# Altium schematic sheet 总电路图.SchDoc
size A2; Organization: Altium Limited; Address1: L3, 12a Rodborough Rd; Address2: Frenchs Forest; Address3: NSW; Address4: Australia 2086
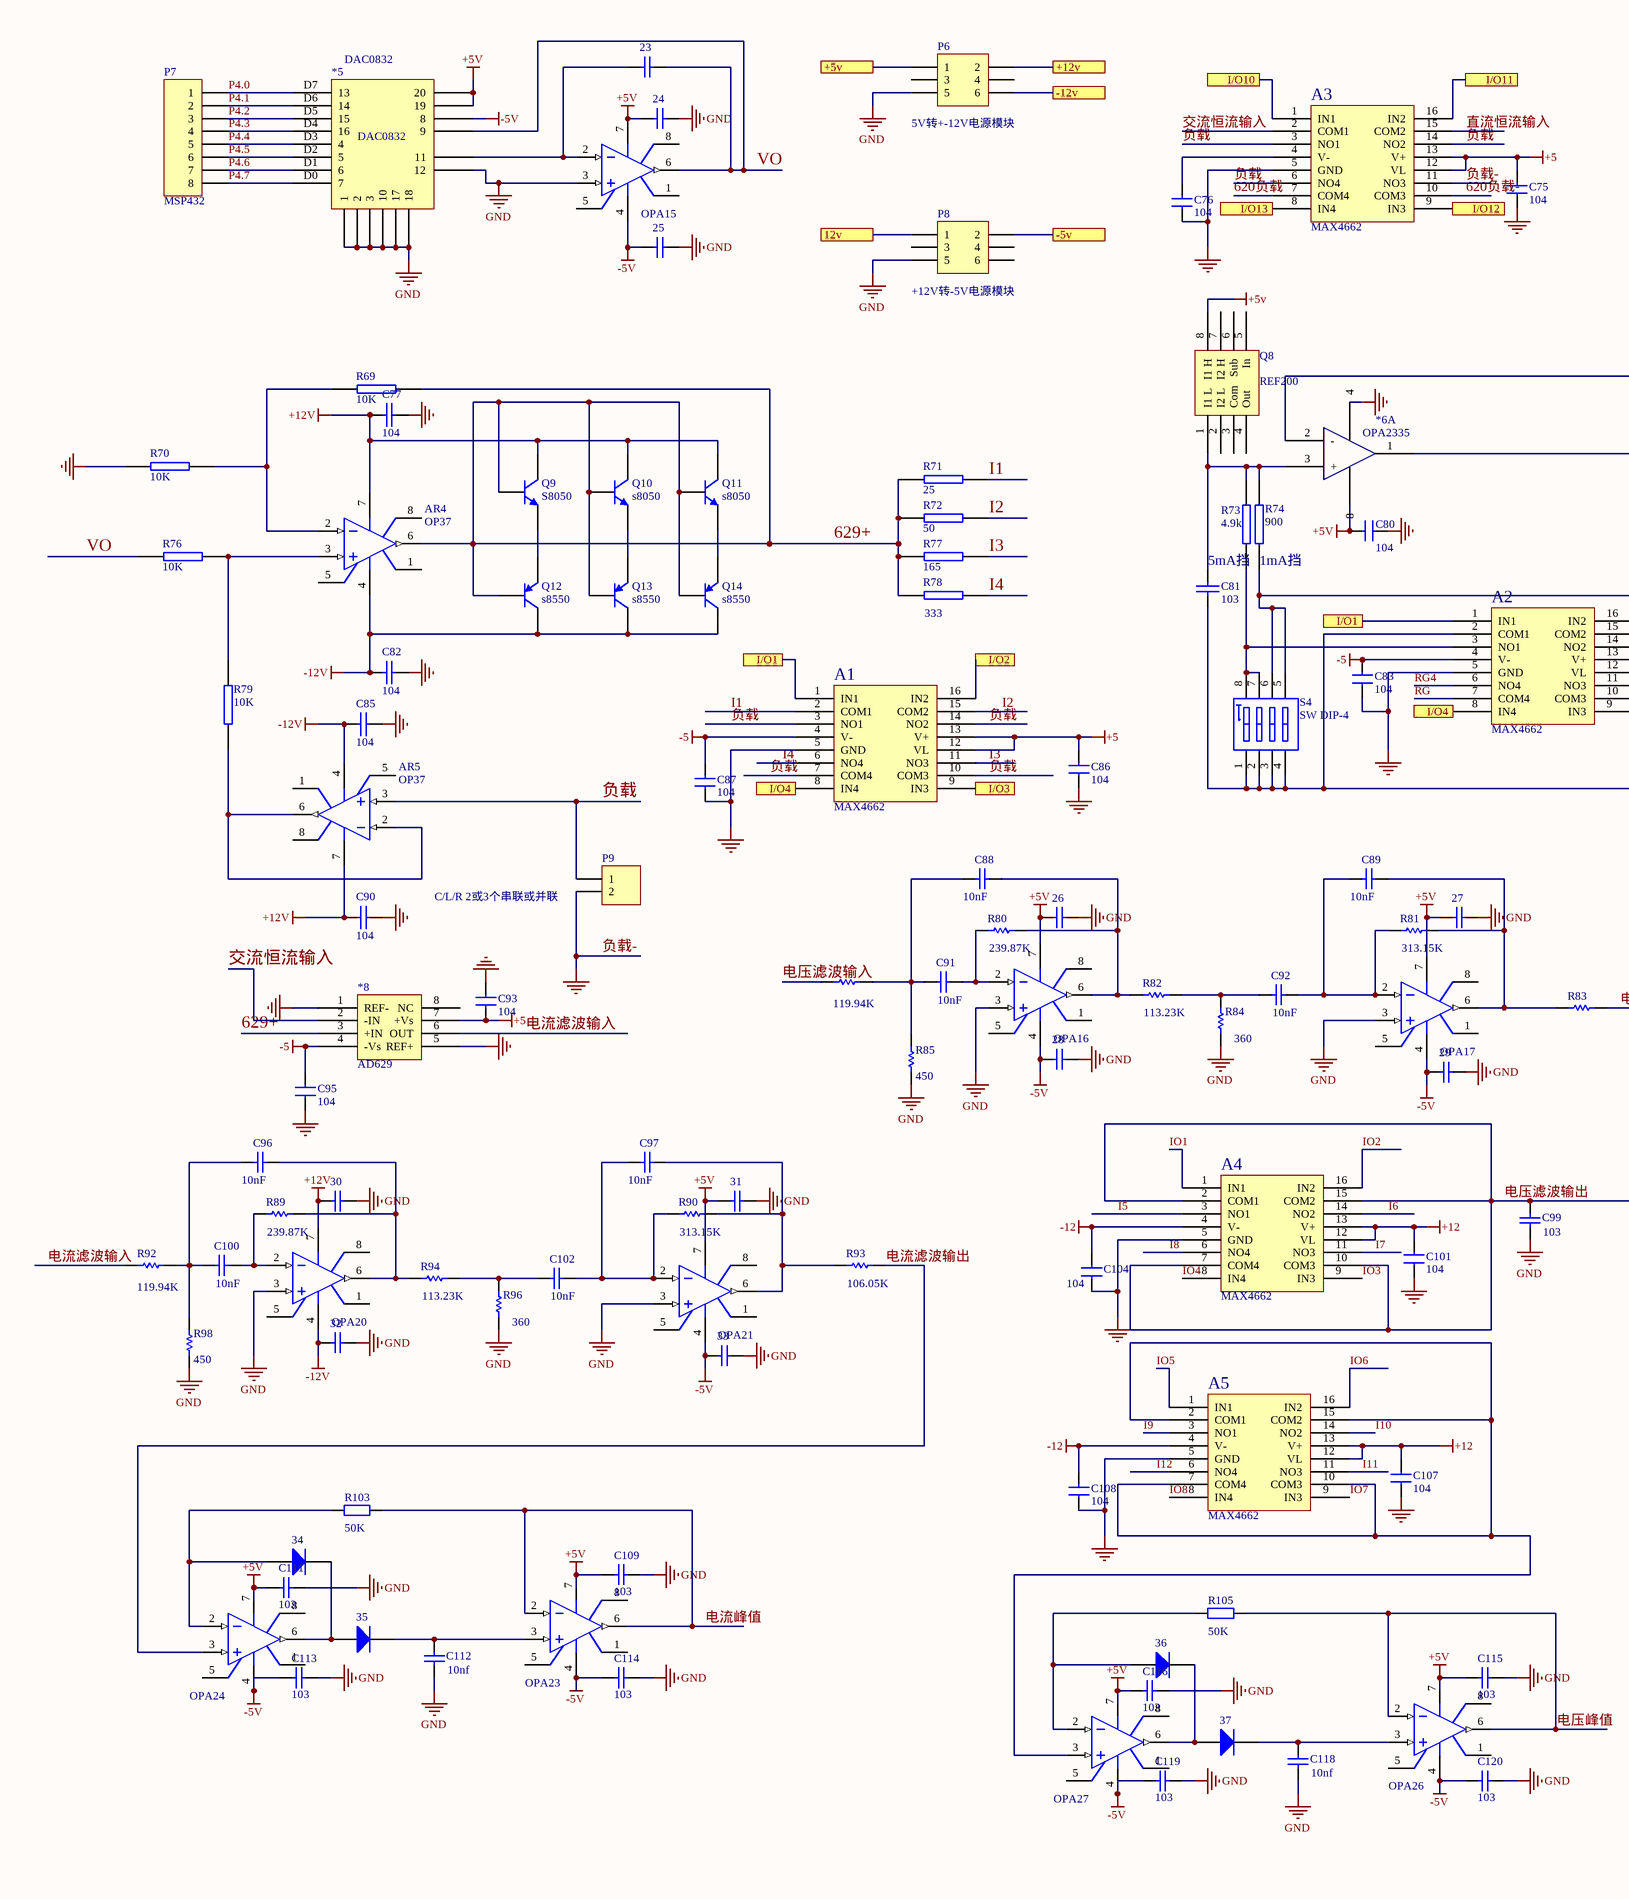
[diagram p0: 总电路图.SchDoc, left]
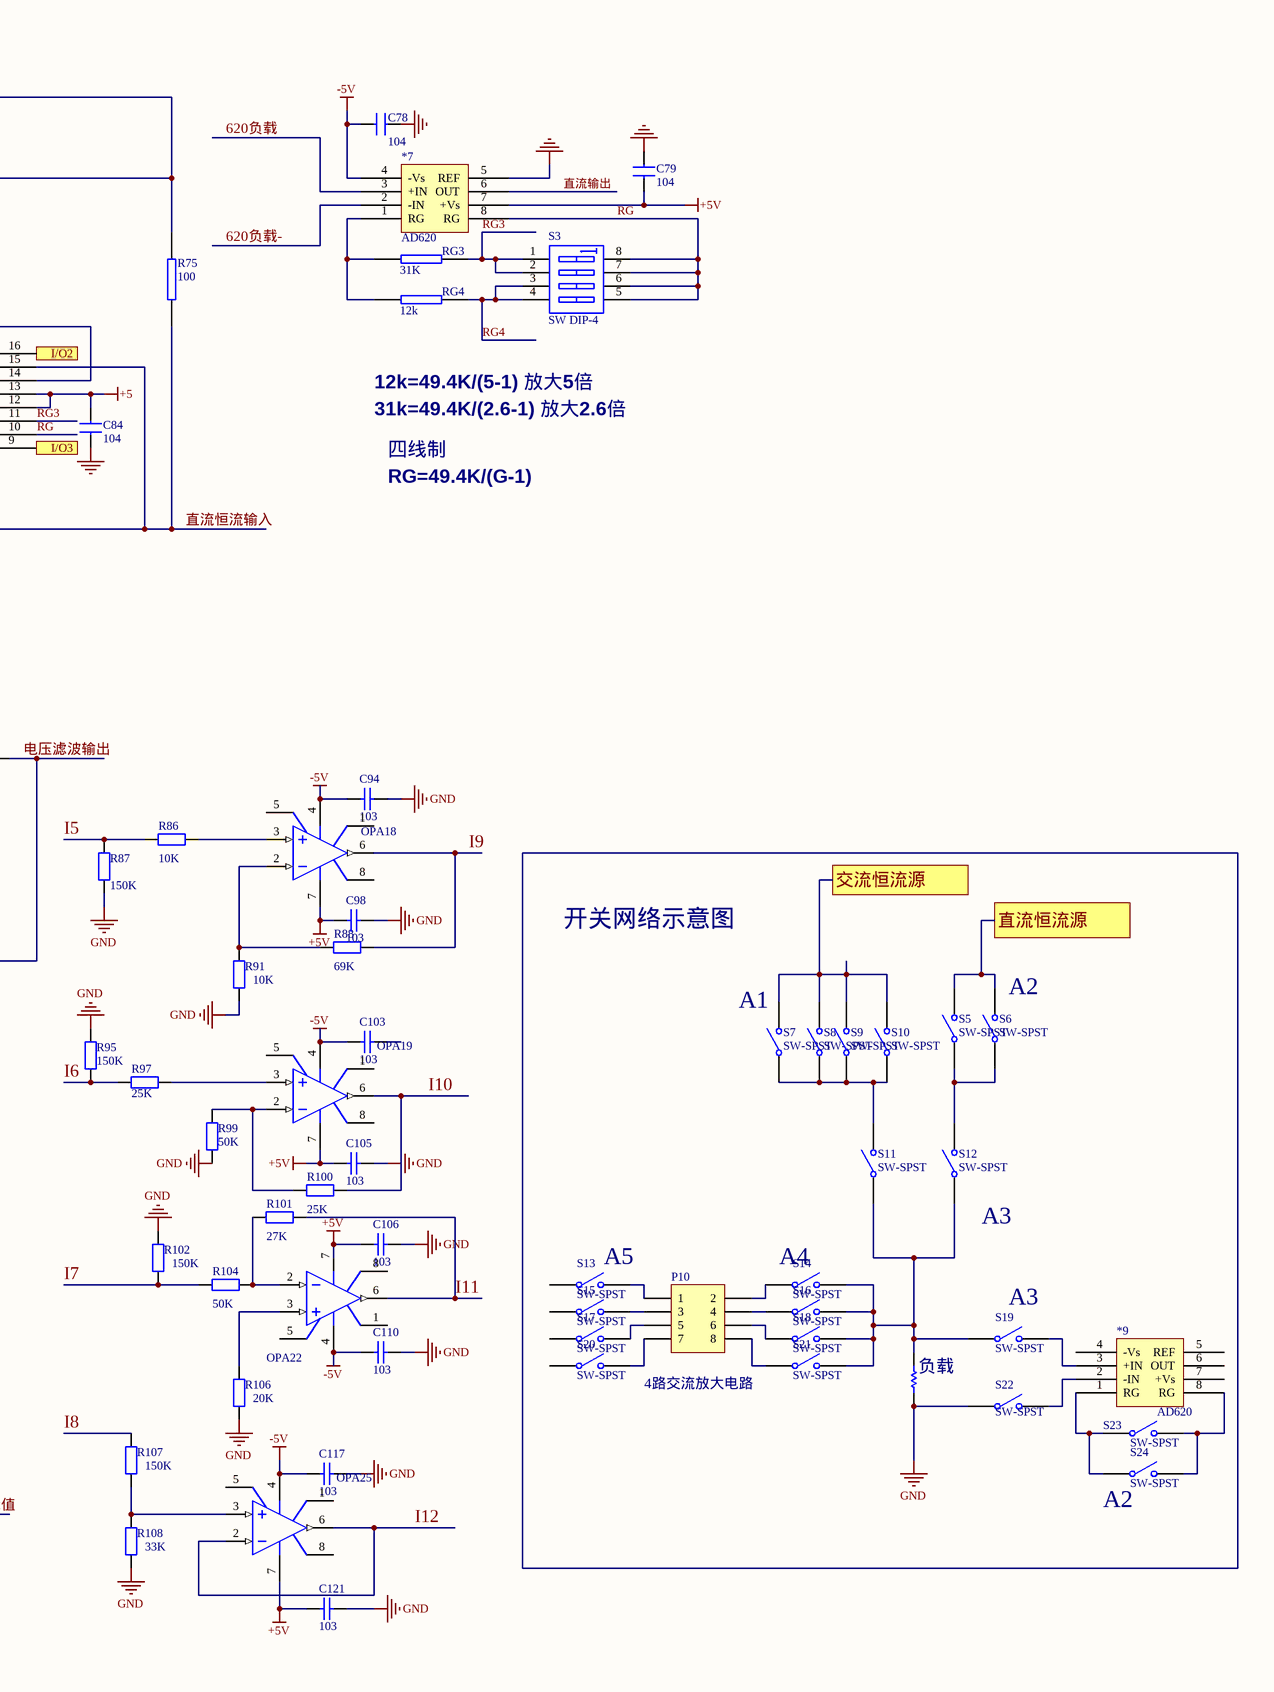
[diagram p1: 总电路图.SchDoc, right]

## Parts
23  Cap  [RAD-0.3]  (value not drawn)
24  Cap  [RAD-0.3]  (value not drawn)
25  Cap  [RAD-0.3]  (value not drawn)
26  Cap  [RAD-0.3]  (value not drawn)
27  Cap  [RAD-0.3]  (value not drawn)
28  Cap  [RAD-0.3]  (value not drawn)
29  Cap  [RAD-0.3]  (value not drawn)
30  Cap  [RAD-0.3]  (value not drawn)
31  Cap  [RAD-0.3]  (value not drawn)
32  Cap  [RAD-0.3]  (value not drawn)
33  Cap  [RAD-0.3]  (value not drawn)
34  Diode 1N4001  [DO-41]  (value not drawn)
35  Diode 1N4001  [DO-41]  (value not drawn)
36  Diode 1N4001  [DO-41]  (value not drawn)
37  Diode 1N4001  [DO-41]  (value not drawn)
*5  DAC0832
*6  OPA2335  (part A of 2)
*7  AD620
*8  AD629
*9  AD620
?  value 119.94K  [AXIAL-0.3]  (hidden comment: Res1)
A1  MAX4662
A2  MAX4662
A3  MAX4662
A4  MAX4662
A5  MAX4662
AR4  OP37  [H-08A]
AR5  OP37  [H-08A]
C75  104  [RAD0.1]
C76  104  [RAD0.1]
C77  104
C78  104  [RAD0.1]
C79  104  [RAD0.1]
C80  104  [RAD0.1]
C81  103
C82  104
C83  104  [RAD0.1]
C84  104  [RAD0.1]
C85  104
C86  104  [RAD0.1]
C87  104  [RAD0.1]
C88  value 10nF  [RAD-0.3]  (hidden comment: Cap)
C89  value 10nF  [RAD-0.3]  (hidden comment: Cap)
C90  104
C91  value 10nF  [RAD-0.3]  (hidden comment: Cap)
C92  value 10nF  [RAD-0.3]  (hidden comment: Cap)
C93  104  [RAD0.1]
C94  value 103  [RAD-0.3]  (hidden comment: Cap)
C95  104  [RAD0.1]
C96  value 10nF  [RAD-0.3]  (hidden comment: Cap)
C97  value 10nF  [RAD-0.3]  (hidden comment: Cap)
C98  value 103  [RAD-0.3]  (hidden comment: Cap)
C99  value 103  [RAD-0.3]  (hidden comment: Cap)
C100  value 10nF  [RAD-0.3]  (hidden comment: Cap)
C101  104  [RAD0.1]
C102  value 10nF  [RAD-0.3]  (hidden comment: Cap)
C103  value 103  [RAD-0.3]  (hidden comment: Cap)
C104  104  [RAD0.1]
C105  value 103  [RAD-0.3]  (hidden comment: Cap)
C106  value 103  [RAD-0.3]  (hidden comment: Cap)
C107  104  [RAD0.1]
C108  104  [RAD0.1]
C109  value 103  [RAD-0.3]  (hidden comment: Cap)
C110  value 103  [RAD-0.3]  (hidden comment: Cap)
C111  value 103  [RAD-0.3]  (hidden comment: Cap)
C112  value 10nf  [RAD-0.3]  (hidden comment: Cap)
C113  value 103  [RAD-0.3]  (hidden comment: Cap)
C114  value 103  [RAD-0.3]  (hidden comment: Cap)
C115  value 103  [RAD-0.3]  (hidden comment: Cap)
C116  value 103  [RAD-0.3]  (hidden comment: Cap)
C117  value 103  [RAD-0.3]  (hidden comment: Cap)
C118  value 10nf  [RAD-0.3]  (hidden comment: Cap)
C119  value 103  [RAD-0.3]  (hidden comment: Cap)
C120  value 103  [RAD-0.3]  (hidden comment: Cap)
C121  value 103  [RAD-0.3]  (hidden comment: Cap)
OPA15  Op Amp  [H-08A]  (value not drawn)
OPA16  Op Amp  [H-08A]  (value not drawn)
OPA17  Op Amp  [H-08A]  (value not drawn)
OPA18  Op Amp  [H-08A]  (value not drawn)
OPA19  Op Amp  [H-08A]  (value not drawn)
OPA20  Op Amp  [H-08A]  (value not drawn)
OPA21  Op Amp  [H-08A]  (value not drawn)
OPA22  Op Amp  [H-08A]  (value not drawn)
OPA23  Op Amp  [H-08A]  (value not drawn)
OPA24  Op Amp  [H-08A]  (value not drawn)
OPA25  Op Amp  [H-08A]  (value not drawn)
OPA26  Op Amp  [H-08A]  (value not drawn)
OPA27  Op Amp  [H-08A]  (value not drawn)
P6  5V转+-12V电源模块  [HDR2X3]
P7  MSP432  [HDR1X8]
P8  +12V转-5V电源模块  [HDR2X3]
P9  C/L/R 2或3个串联或并联  [HDR1X2H]
P10  4路交流放大电路  [HDR2X4]
Q8  REF200
Q9  S8050  [TO-92A]
Q10  s8050  [TO-92A]
Q11  s8050  [TO-92A]
Q12  s8550  [TO-92A]
Q13  s8550  [TO-92A]
Q14  s8550  [TO-92A]
R69  10K
R70  10K
R71  25
R72  50
R73  4.9k
R74  900
R75  100
R76  10K
R77  165
R78  333  [AXIAL0.3]
R79  10K
R80  value 239.87K  [AXIAL-0.3]  (hidden comment: Res1)
R81  value 313.15K  [AXIAL-0.3]  (hidden comment: Res1)
R82  value 113.23K  [AXIAL-0.3]  (hidden comment: Res1)
R83  Res1  [AXIAL-0.3]  (value not drawn)
R84  value 360  [AXIAL-0.3]  (hidden comment: Res1)
R85  value 450  [AXIAL-0.3]  (hidden comment: Res1)
R86  value 10K  [AXIAL-0.4]  (hidden comment: Res2)
R87  value 150K  [AXIAL-0.4]  (hidden comment: Res2)
R88  value 69K  [AXIAL-0.4]  (hidden comment: Res2)
R89  value 239.87K  [AXIAL-0.3]  (hidden comment: Res1)
R90  value 313.15K  [AXIAL-0.3]  (hidden comment: Res1)
R91  value 10K  [AXIAL-0.4]  (hidden comment: Res2)
R92  value 119.94K  [AXIAL-0.3]  (hidden comment: Res1)
R93  value 106.05K  [AXIAL-0.3]  (hidden comment: Res1)
R94  value 113.23K  [AXIAL-0.3]  (hidden comment: Res1)
R95  value 150K  [AXIAL-0.4]  (hidden comment: Res2)
R96  value 360  [AXIAL-0.3]  (hidden comment: Res1)
R97  value 25K  [AXIAL-0.4]  (hidden comment: Res2)
R98  value 450  [AXIAL-0.3]  (hidden comment: Res1)
R99  value 50K  [AXIAL-0.4]  (hidden comment: Res2)
R100  value 25K  [AXIAL-0.4]  (hidden comment: Res2)
R101  value 27K  [AXIAL-0.4]  (hidden comment: Res2)
R102  value 150K  [AXIAL-0.4]  (hidden comment: Res2)
R103  value 50K  [AXIAL-0.4]  (hidden comment: Res2)
R104  value 50K  [AXIAL-0.4]  (hidden comment: Res2)
R105  value 50K  [AXIAL-0.4]  (hidden comment: Res2)
R106  value 20K  [AXIAL-0.4]  (hidden comment: Res2)
R107  value 150K  [AXIAL-0.4]  (hidden comment: Res2)
R108  value 33K  [AXIAL-0.4]  (hidden comment: Res2)
RG3  31K  [AXIAL0.3]
RG4  12k  [AXIAL0.3]
S3  SW DIP-4  [SO8_N]
S4  SW DIP-4  [SO8_N]
S5  SW-SPST  [SPST-2]
S6  SW-SPST  [SPST-2]
S7  SW-SPST  [SPST-2]
S8  SW-SPST  [SPST-2]
S9  SW-SPST  [SPST-2]
S10  SW-SPST  [SPST-2]
S11  SW-SPST  [SPST-2]
S12  SW-SPST  [SPST-2]
S13  SW-SPST  [SPST-2]
S14  SW-SPST  [SPST-2]
S15  SW-SPST  [SPST-2]
S16  SW-SPST  [SPST-2]
S17  SW-SPST  [SPST-2]
S18  SW-SPST  [SPST-2]
S19  SW-SPST  [SPST-2]
S20  SW-SPST  [SPST-2]
S21  SW-SPST  [SPST-2]
S22  SW-SPST  [SPST-2]
S23  SW-SPST  [SPST-2]
S24  SW-SPST  [SPST-2]
负载  Res1  [AXIAL-0.3]  (value not drawn)

## Ports
12v, +5v, +12v, -5v, -12v, I/O1, I/O2, I/O3, I/O4, I/O10, I/O11, I/O12, I/O13, 交流恒流源, 直流恒流源

## Nets
+5: *8.7(+Vs) A1.12(VL) A1.13(V+) A2.12(VL) A2.13(V+) A3.12(VL) A3.13(V+) C75.1 C84.1 C86.1 C93.1
+5V: 24.1 26.1 27.1 31.1 *5.D14(20) *5.D15(19) *7.7(+Vs) C79.1 C80.1 C98.2 C105.2 C106.2 C109.2 C111.2 C115.2 C116.2 C121.2 OPA15.7(V+) OPA16.7(V+) OPA17.7(V+) OPA18.7(V+) OPA19.7(V+) OPA21.7(V+) OPA22.7(V+) OPA23.7(V+) OPA24.7(V+) OPA25.7(V+) OPA26.7(V+) OPA27.7(V+) Q8.8(I1_H)
+12: A4.12(VL) A4.13(V+) A5.12(VL) A5.13(V+) C101.1 C107.1
+12V: 30.1 AR4.7(V+) AR5.7(V+) C77.1 C90.1 OPA20.7(V+) Q9.3(C) Q10.3(C) Q11.3(C)
-5: *8.4(-Vs) A1.4(V-) A2.4(V-) C83.2 C87.2 C95.1
-5V: 25.1 28.1 29.1 33.1 *5.D16(8) *7.4(-Vs) C78.1 C94.2 C103.2 C110.2 C113.2 C114.2 C117.2 C119.2 C120.2 OPA15.4(V-) OPA16.4(V-) OPA17.4(V-) OPA18.4(V-) OPA19.4(V-) OPA21.4(V-) OPA22.4(V-) OPA23.4(V-) OPA24.4(V-) OPA25.4(V-) OPA26.4(V-) OPA27.4(V-)
-12: A4.4(V-) A5.4(V-) C104.2 C108.2
-12V: 32.1 AR4.4(V-) AR5.4(V-) C82.1 C85.1 OPA20.4(V-) Q12.3(C) Q13.3(C) Q14.3(C)
GND: 24.2 25.2 26.2 27.2 28.2 29.2 30.2 31.2 32.2 33.2 *5.D8(1) *5.D9(2) *5.D10(3) *5.D11(10) *5.D12(17) *5.D13(18) *5.D19(12) A1.5(GND) A2.5(GND) A3.5(GND) A4.5(GND) A5.5(GND) C75.2 C76.1 C77.2 C78.2 C79.2 C80.2 C82.2 C83.1 C84.2 C85.2 C86.2 C87.1 C90.2 C93.2 C94.1 C95.2 C98.1 C99.1 C101.2 C104.1 C105.1 C106.1 C107.2 C108.1 C109.1 C110.1 C111.1 C112.2 C113.1 C114.1 C115.1 C116.1 C117.1 C118.2 C119.1 C120.1 C121.1 OPA15.3(IN+) OPA16.3(IN+) OPA17.3(IN+) OPA20.3(IN+) OPA21.3(IN+) P6.5 P8.5 R70.2 R84.1 R85.1 R87.2 R91.1 R95.2 R96.1 R98.1 R99.1 R102.2 R106.2 R108.2 S22.1(COMMON) 负载.1
负载-: *7.5(REF) *8.1(REF-) *8.5(REF+) A3.11(NO3) P9.2
12v: P8.1 ; port 12v
620负载: *7.3(+IN) A3.7(COM4)
620负载-: *7.2(-IN) A3.10(COM3)
629+: *8.3(+IN) AR4.6(OUT) Q9.2(B) Q10.2(B) Q11.2(B) Q12.2(B) Q13.2(B) Q14.2(B) R69.2 R71.1 R72.1 R77.1 R78.2
+5v: P6.1 ; port +5v  [a separate net that carries the same name]
+12v: P6.2 ; port +12v  [a separate net that carries the same name]
-5v: P8.2 ; port -5v  [a separate net that carries the same name]
-12v: P6.6 ; port -12v  [a separate net that carries the same name]
I1: A1.2(COM1) R71.2
I2: A1.15(COM2) R72.2
I3: A1.11(NO3) R77.2
I4: A1.6(NO4) R78.1
I5: A4.3(NO1) R86.1 R87.1
I6: A4.14(NO2) R95.1 R97.1
I7: A4.11(NO3) R102.1 R104.2
I8: A4.6(NO4) R107.1
I9: A5.3(NO1) OPA18.6(OUT) R88.1
I10: A5.14(NO2) OPA19.6(OUT) R100.1
I11: A5.11(NO3) OPA22.6(OUT) R101.1
I12: A5.6(NO4) OPA25.2(IN-) OPA25.6(OUT)
I/O1: A1.1(IN1) A2.1(IN1) ; port I/O1
I/O2: A1.16(IN2) A2.16(IN2) ; port I/O2
I/O3: A1.9(IN3) A2.9(IN3) ; port I/O3
I/O4: A1.8(IN4) A2.8(IN4) ; port I/O4
I/O10: A3.1(IN1) ; port I/O10
I/O11: A3.16(IN2) ; port I/O11
I/O12: A3.9(IN3) ; port I/O12
I/O13: A3.8(IN4) ; port I/O13
IO1: A4.1(IN1)
IO2: A4.16(IN2)
IO3: A4.9(IN3)
IO4: A4.8(IN4)
IO5: A5.1(IN1)
IO6: A5.16(IN2)
IO7: A5.9(IN3)
IO8: A5.8(IN4)
P4.0: *5.D7(13) P7.1
P4.1: *5.D6(14) P7.2
P4.2: *5.D5(15) P7.3
P4.3: *5.D4(16) P7.4
P4.4: *5.D3(4) P7.5
P4.5: *5.D2(5) P7.6
P4.6: *5.D1(6) P7.7
P4.7: *5.D0(7) P7.8
RG: *7.8(RG) A2.7(COM4) A2.10(COM3) S3.5(B4) S3.6(B3) S3.7(B2) S3.8(B1)
RG3: A2.11(NO3) RG3.2 S3.1(A1) S3.2(A2)
RG4: A2.6(NO4) RG4.2 S3.3(A3) S3.4(A4)
VO: 23.2 *5.D17(9) OPA15.6(OUT) R76.1
交流恒流源: S7.2(NO) S8.2(NO) S9.2(NO) S10.2(NO) ; port 交流恒流源
交流恒流输入: *8.2(-IN) A3.2(COM1)
电压峰值: OPA26.2(IN-) OPA26.6(OUT) R105.2
电压滤波输入: ?.1
电压滤波输出: A4.2(COM1) A4.7(COM4) A4.10(COM3) A4.15(COM2) C99.2 R83.2
电流峰值: OPA23.2(IN-) OPA23.6(OUT) R103.2
电流滤波输入: *8.6(OUT) R92.1
电流滤波输出: OPA24.3(IN+) R93.2
直流恒流源: S5.2(NO) S6.2(NO) ; port 直流恒流源
直流恒流输入: A2.2(COM1) A2.15(COM2) A3.15(COM2) C81.1 R75.1 S4.1(A1) S4.2(A2) S4.3(A3) S4.4(A4)
直流输出: *7.6(OUT)
负载: A1.3(NO1) A1.7(COM4) A1.10(COM3) A1.14(NO2) A3.3(NO1) A3.6(NO4) A3.14(NO2) AR5.3(IN+) P9.1
Net23_1: 23.1 *5.D18(11) OPA15.2(IN-)
Net34_1: 34.1(A) OPA24.2(IN-) R103.1
Net34_2: 34.2(K) 35.1(A) OPA24.6(OUT)
Net35_2: 35.2(K) C112.1 OPA23.3(IN+)
Net36_1: 36.1(A) OPA27.2(IN-) R105.1
Net36_2: 36.2(K) 37.1(A) OPA27.6(OUT)
Net37_2: 37.2(K) C118.1 OPA26.3(IN+)
Net*6_1: *6.1 *6.2(-) R75.2
Net*6_3: *6.3(+) C81.2 Q8.1(I1_L) R73.2 R74.2
Net*7_1: *7.1(RG) RG3.1 RG4.1
Net*9_1: *9.1(RG) S23.1(COMMON) S24.1(COMMON)
Net*9_2: *9.2(-IN) S22.2(NO)
Net*9_3: *9.3(+IN) S19.2(NO)
Net*9_8: *9.8(RG) S23.2(NO) S24.2(NO)
Net?_2: ?.2 C88.1 C91.1 R85.2
NetA2_3: A2.3(NO1) R73.1 S4.7(B2) S4.8(B1)
NetA2_14: A2.14(NO2) R74.1 S4.5(B4) S4.6(B3)
NetA3_4: A3.4(V-) C76.2
NetA5_2: A5.2(COM1) A5.7(COM4) A5.10(COM3) A5.15(COM2) OPA27.3(IN+)
NetAR4_2: AR4.2(IN-) R69.1 R70.1
NetAR4_3: AR4.3(IN+) R76.2 R79.1
NetAR5_2: AR5.2(IN-) AR5.6(OUT) R79.2
NetC88_2: C88.2 OPA16.6(OUT) R80.2 R82.1
NetC89_1: C89.1 C92.2 OPA17.2(IN-) R81.1
NetC89_2: C89.2 OPA17.6(OUT) R81.2 R83.1
NetC91_2: C91.2 OPA16.2(IN-) R80.1
NetC92_1: C92.1 R82.2 R84.2
NetC96_1: C96.1 C100.1 R92.2 R98.2
NetC96_2: C96.2 OPA20.6(OUT) R89.2 R94.1
NetC97_1: C97.1 C102.2 OPA21.2(IN-) R90.1
NetC97_2: C97.2 OPA21.6(OUT) R90.2 R93.1
NetC100_2: C100.2 OPA20.2(IN-) R89.1
NetC102_1: C102.1 R94.2 R96.2
NetOPA18_2: OPA18.2(IN-) R88.2 R91.2
NetOPA18_3: OPA18.3(IN+) R86.2
NetOPA19_2: OPA19.2(IN-) R99.2 R100.2
NetOPA19_3: OPA19.3(IN+) R97.2
NetOPA22_2: OPA22.2(IN-) R101.2 R104.1
NetOPA22_3: OPA22.3(IN+) R106.1
NetOPA25_3: OPA25.3(IN+) R107.2 R108.1
NetP10_1: P10.1 S13.2(NO)
NetP10_2: P10.2 S14.1(COMMON)
NetP10_3: P10.3 S15.2(NO)
NetP10_4: P10.4 S16.1(COMMON)
NetP10_5: P10.5 S17.2(NO)
NetP10_6: P10.6 S18.1(COMMON)
NetP10_7: P10.7 S20.2(NO)
NetP10_8: P10.8 S21.1(COMMON)
NetQ9_1: Q9.1(E) Q12.1(E)
NetQ10_1: Q10.1(E) Q13.1(E)
NetQ11_1: Q11.1(E) Q14.1(E)
NetS5_1: S5.1(COMMON) S6.1(COMMON) S12.2(NO)
NetS7_1: S7.1(COMMON) S8.1(COMMON) S9.1(COMMON) S10.1(COMMON) S11.2(NO)
NetS11_1: S11.1(COMMON) S12.1(COMMON) S14.2(NO) S16.2(NO) S18.2(NO) S19.1(COMMON) S21.2(NO) 负载.2

Not connected (* = marked no-connect by the designer): *6 ?1(4) ?2(8); *8 8(NC); *9 4(-Vs) 5(REF) 6(OUT) 7(+Vs); AR4 1(OS_NUL) 5(OS_NUL) 8(TAB); AR5 1(OS_NUL) 5(OS_NUL) 8(TAB); C103 1; OPA15 1(OS_NUL) 5(OS_NUL) 8(TAB); OPA16 1(OS_NUL) 5(OS_NUL) 8(TAB); OPA17 1(OS_NUL) 5(OS_NUL) 8(TAB); OPA18 1(OS_NUL) 5(OS_NUL) 8(TAB); OPA19 1(OS_NUL) 5(OS_NUL) 8(TAB); OPA20 1(OS_NUL) 5(OS_NUL) 8(TAB); OPA21 1(OS_NUL) 5(OS_NUL) 8(TAB); OPA22 1(OS_NUL) 5(OS_NUL) 8(TAB); OPA23 1(OS_NUL) 5(OS_NUL) 8(TAB); OPA24 1(OS_NUL) 5(OS_NUL) 8(TAB); OPA25 1(OS_NUL) 5(OS_NUL) 8(TAB); OPA26 1(OS_NUL) 5(OS_NUL) 8(TAB); OPA27 1(OS_NUL) 5(OS_NUL) 8(TAB); P6 3 4; P8 3 4 6; Q8 2(I2_L) 3(Com) 4(Out) 5(In) 6(Sub) 7(I2_H); S13 1(COMMON); S15 1(COMMON); S17 1(COMMON); S20 1(COMMON)

## Notes on the sheet
- 5mA挡
- 1mA挡
- 12k=49.4K/(5-1) 放大5倍
- 31k=49.4K/(2.6-1) 放大2.6倍
- 四线制
- RG=49.4K/(G-1)
- 开关网络示意图
- (near S7) A1
- (near S6) A2
- (near S13) A5
- (near S14) A4
- (near S12) A3
- (near S19) A3
- (near S24) A2
- Title
- Size:
- Date:
- File:
- Number:
- Time:
- Revision:
- Sheet
- of

## Library data of the parts
23-33 = Cap: Capacitor; Value: 100pF; Published: 8-Jun-2000; LatestRevisionDate: 17-Jul-2002; LatestRevisionNote: Re-released for DXP Platform.; PackageReference: RAD-0.3; Publisher: Altium Limited; PackageDescription: Radial Cap, Thru-Hole; 2 Leads; 0.3 in Pin Spacing
34-37 = Diode 1N4001: 1 Amp General Purpose Rectifier; Published: 8-Jun-2000; LatestRevisionDate: 17-Jul-2002; LatestRevisionNote: Re-released for DXP Platform.; DatasheetVersion: 1998; PackageVersion: Aug-1999; PackageReference: DO-41; Publisher: Altium Limited; PackageDescription: Diode, Axial; Body 5.2 x 2.7 mm (LxDia. max), Lead Dia. 0.86 mm (max); Code_JEDEC: DO-204-AL; ComponentLink1Description: Manufacturer Link; ComponentLink1URL: http://www.fairchildsemi.com/; ComponentLink2Description: Datasheet; ComponentLink2URL: http://www.fairchildsemi.com/ds/1N%2F1N4001.pdf
*5 Q8 = Component_1
? R80-R85 R89 R90 R92-R94 R96 R98 负载 = Res1: Resistor; Published: 8-Jun-2000; LatestRevisionDate: 17-Jul-2002; LatestRevisionNote: Re-released for DXP Platform.; PackageReference: AXIAL-0.3; Publisher: Altium Limited; PackageDescription: Axial Device, Thru-Hole; 2 Leads; 0.3 in Pin Spacing
A1-A5 = MAX2662
AR4 AR5 OPA15-OPA27 = Op Amp: FET Operational Amplifier; Published: 8-Jun-2000; LatestRevisionDate: 17-Jul-2002; LatestRevisionNote: Re-released for DXP Platform.; DatasheetVersion: REV. B; PackageVersion: 1990; PackageReference: H-08A; Publisher: Altium Limited; PackageDescription: Can; 8 Leads; Pin Circle Dia. 5.08 mm; Lead Dia. 0.53 mm (max); ComponentLink1Description: Manufacturer Link; ComponentLink1URL: http://www.analog.com/
C75-C87 C90 C93 C95 C101 C104 C107 C108 = CAP: Capacitor
  C75 C76 C78-C80 C83 C84 C86 C87 C93 C95 C101 C104 C107 C108: Value: 104
C88 C89 C91 C92 C94 C96-C100 C102 C103 C105 C106 C109-C121 = Cap: Capacitor; Published: 8-Jun-2000; LatestRevisionDate: 17-Jul-2002; LatestRevisionNote: Re-released for DXP Platform.; PackageReference: RAD-0.3; Publisher: Altium Limited; PackageDescription: Radial Cap, Thru-Hole; 2 Leads; 0.3 in Pin Spacing
P6 P8 = Header 3X2: Header, 3-Pin, Dual row; LatestRevisionDate: 17-Jul-2002; LatestRevisionNote: Re-released for DXP Platform.; Publisher: Altium Limited
P7 = Header 8: Header, 8-Pin; LatestRevisionDate: 17-Jul-2002; LatestRevisionNote: Re-released for DXP Platform.; Publisher: Altium Limited
P9 = Header 2H: Header, 2-Pin, Right Angle; LatestRevisionDate: 17-Jul-2002; LatestRevisionNote: Re-released for DXP Platform.; Publisher: Altium Limited
P10 = Header 4X2: Header, 4-Pin, Dual row; LatestRevisionDate: 17-Jul-2002; LatestRevisionNote: Re-released for DXP Platform.; Publisher: Altium Limited
Q9-Q11 = 2N3904: NPN General Purpose Amplifier; Published: 8-Jun-2000; LatestRevisionDate: 15-Jan-2003; LatestRevisionNote: PCB Footprint 'BCY-W3/D4.7' replaced; DatasheetVersion: 1997; PackageVersion: Sep-1998; PackageReference: TO-92A; Publisher: Altium Limited; PackageDescription: TO, Flat Index; 3 In-Line, Axial Leads; Body Dia. 4.5mm; Leads 0.51 x 0.48 mm (max); ComponentLink1Description: Manufacturer Link; ComponentLink1URL: http://www.fairchildsemi.com/; ComponentLink2Description: Datasheet; ComponentLink2URL: http://www.fairchildsemi.com/ds/2N%2F2N3904.pdf
Q12-Q14 = 2N3906: PNP General Purpose Amplifier; Published: 8-Jun-2000; LatestRevisionDate: 15-Jan-2003; LatestRevisionNote: PCB Footprint 'BCY-W3/D4.7' replaced; DatasheetVersion: 1997; PackageVersion: Sep-1998; PackageReference: TO-92A; Publisher: Altium Limited; PackageDescription: TO, Flat Index; 3 In-Line, Axial Leads; Body Dia. 4.5mm; Leads 0.51 x 0.48 mm (max); ComponentLink1Description: Manufacturer Link; ComponentLink1URL: http://www.fairchildsemi.com/; ComponentLink2Description: Datasheet; ComponentLink2URL: http://www.fairchildsemi.com/ds/2N%2F2N3906.pdf
R69-R79 RG3 RG4 = RES2
R86-R88 R91 R95 R97 R99-R108 = Res2: Resistor; Published: 8-Jun-2000; LatestRevisionDate: 17-Jul-2002; LatestRevisionNote: Re-released for DXP Platform.; PackageReference: AXIAL-0.4; Publisher: Altium Limited; PackageDescription: Axial Device, Thru-Hole; 2 Leads; 0.4 in Pin Spacing
S3 S4 = SW DIP-4: DIP Switch, 4 Position, SPST; Published: 24-Mar-1999; LatestRevisionDate: 29-May-2009; LatestRevisionNote: IPC-7351 Footprint Added.; PackageVersion: Dec-2002; PackageReference: SO8; Publisher: Altium Limited; PackageDescription: 8-Pin Small Outline Integrated Circuit 1.27 mm Pitch; Code_JEDEC: MS-012-AA; Code_IPC: SOIC127P600-8
S5-S24 = SW-SPST: Single-Pole, Single-Throw Switch; Published: 24-Mar-1999; LatestRevisionDate: 17-Jul-2002; LatestRevisionNote: Re-released for DXP Platform.; PackageReference: SPST-2; Publisher: Altium Limited; PackageDescription: Switch; 2 Leads